# Altium schematic sheet PowerDomain.SchDoc: Shaheen PCB Board
size A3; Author: Mattia Sinigaglia; CompanyName: University of Bologna; DrawnBy: Mattia Sinigaglia; Organization: EES - Micrel Lab; Revision: v1; SheetNumber: 3; SheetTotal: 6
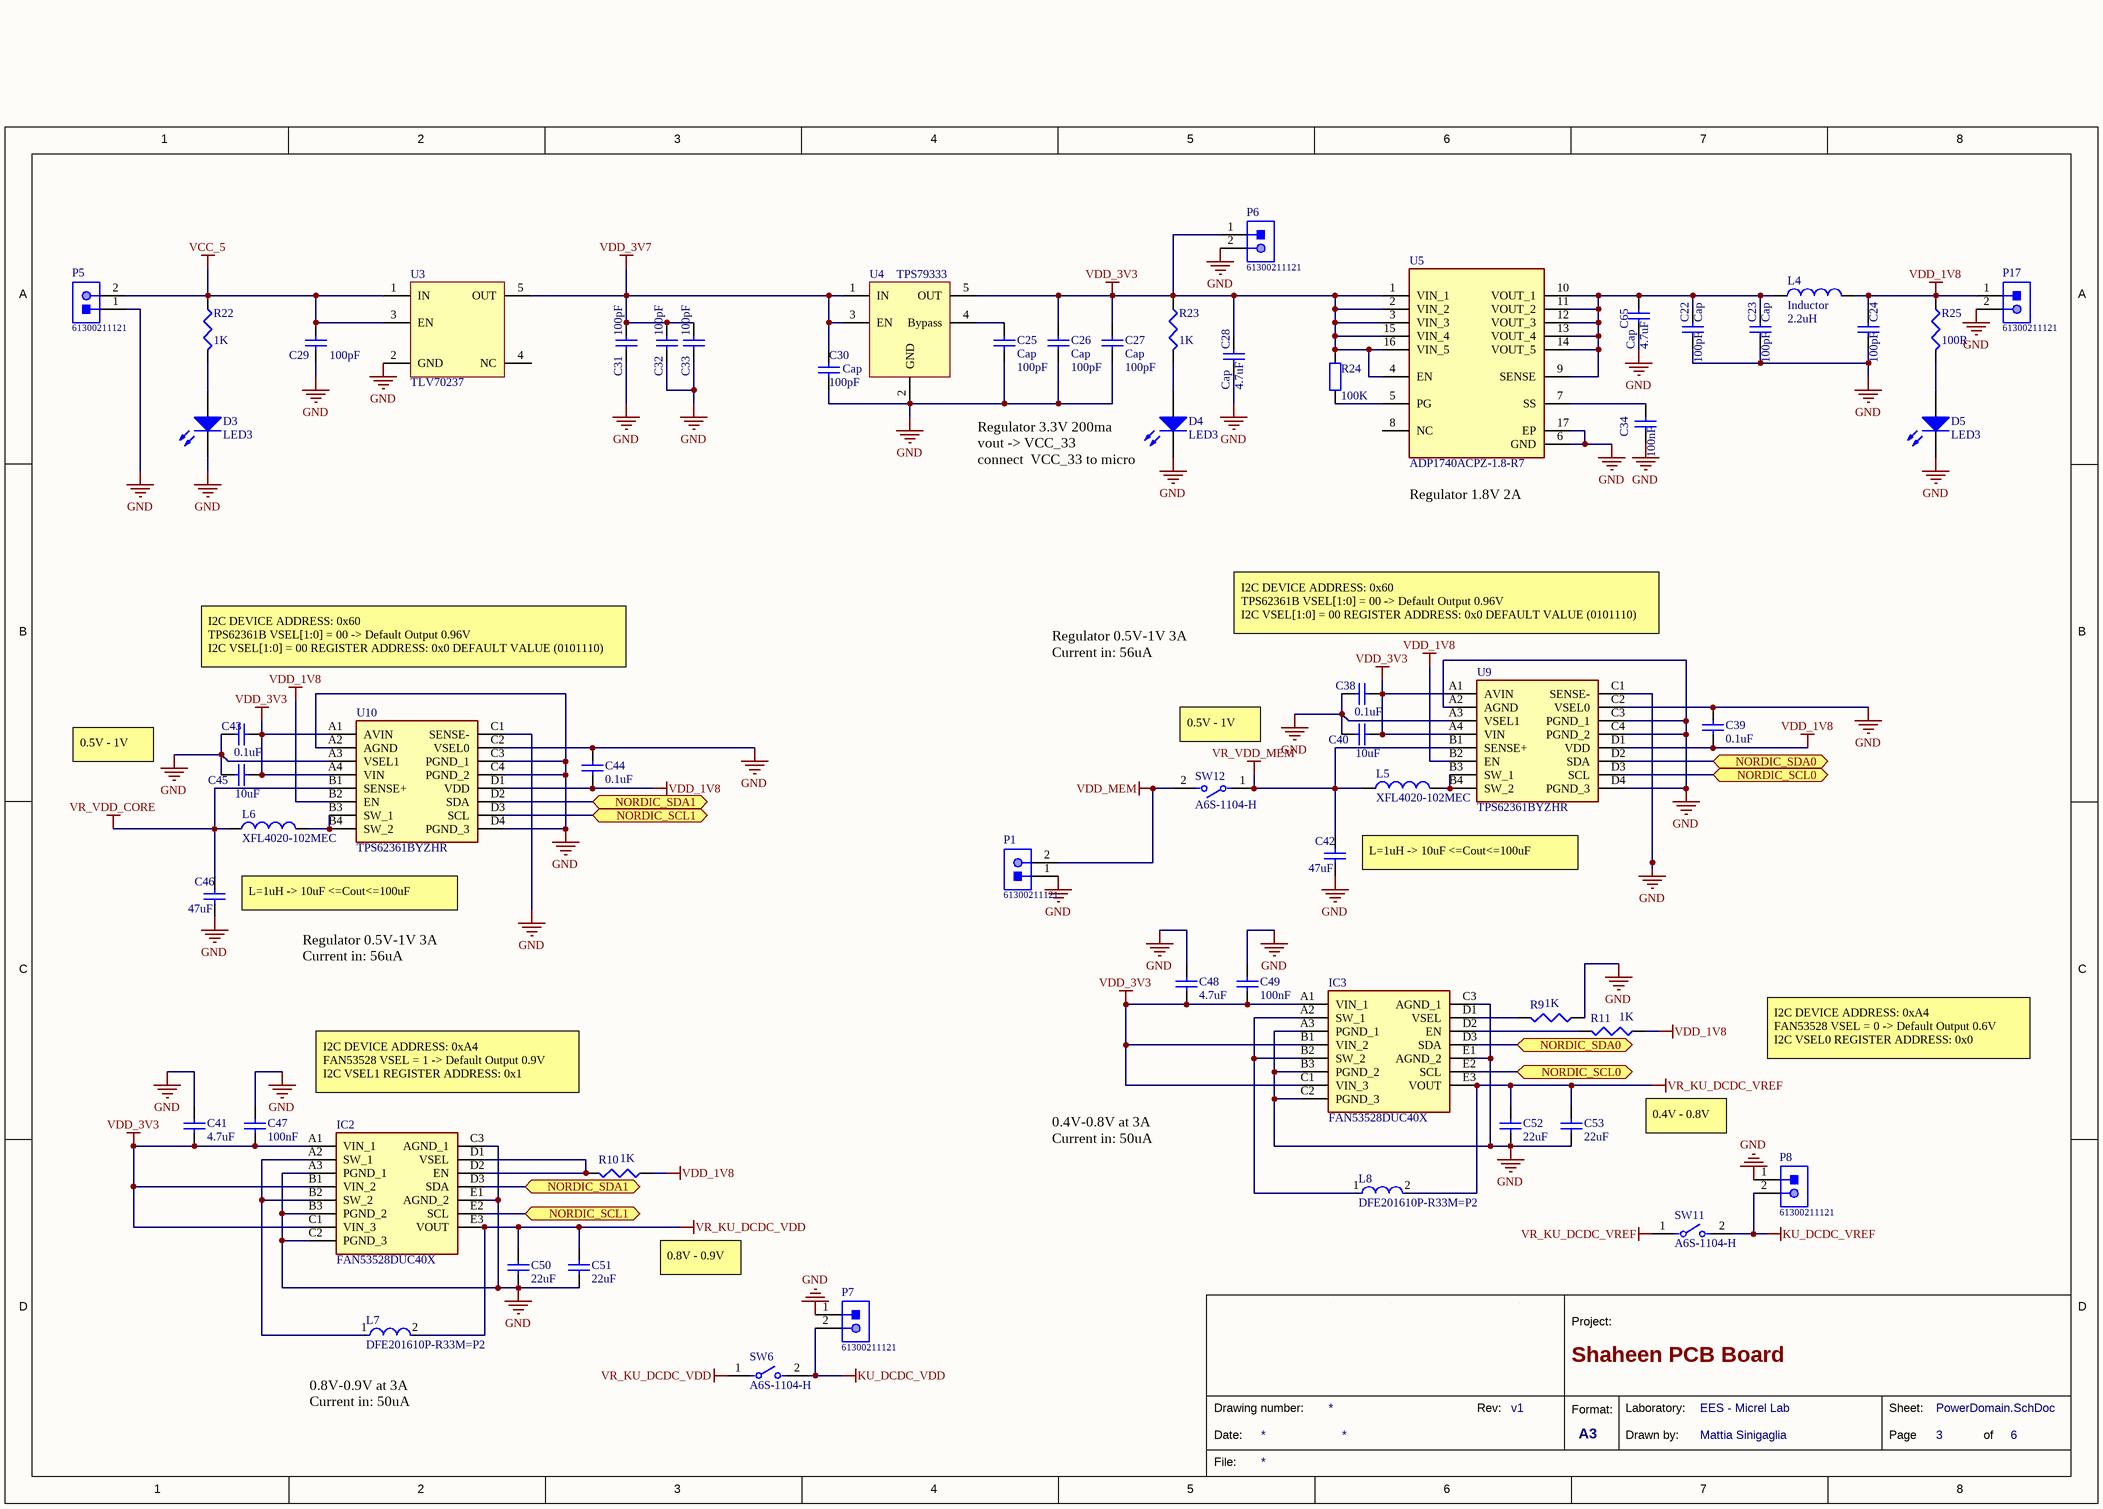
[diagram p0: PowerDomain.SchDoc]

## Parts
C22  Cap  value 100pF  [0603]
C23  Cap  value 100pF  [0603]
C24  value 100pF  [0603]  (hidden comment: Cap)
C25  Cap  value 100pF  [cap_0402_R - modified]
C26  Cap  value 100pF  [cap_0402_R - modified]
C27  Cap  value 100pF  [cap_0402_R - modified]
C28  Cap  value 4.7uF  [0603]
C29  value 100pF  [1608[0603]]  (hidden comment: Cap Semi)
C30  Cap  value 100pF  [cap_0402_R - modified]
C31  value 100pF  [1608[0603]]  (hidden comment: Cap Semi)
C32  value 100pF  [1608[0603]]  (hidden comment: Cap Semi)
C33  value 100pF  [1608[0603]]  (hidden comment: Cap Semi)
C34  value 100nF  [0603]
C38  value 0.1uF  [0603]  (hidden comment: Cap)
C39  value 0.1uF  [0603]  (hidden comment: Cap)
C40  value 10uF  [0603]  (hidden comment: Cap)
C41  value 4.7uF  [0603]  (hidden comment: Cap)
C42  value 47uF  [0603]  (hidden comment: Cap)
C43  value 0.1uF  [0603]  (hidden comment: Cap)
C44  value 0.1uF  [0603]  (hidden comment: Cap)
C45  value 10uF  [0603]  (hidden comment: Cap)
C46  value 47uF  [0603]  (hidden comment: Cap)
C47  value 100nF  [0603]  (hidden comment: Cap)
C48  value 4.7uF  [0603]  (hidden comment: Cap)
C49  value 100nF  [0603]  (hidden comment: Cap)
C50  value 22uF  [0603]  (hidden comment: Cap)
C51  value 22uF  [0603]  (hidden comment: Cap)
C52  value 22uF  [0603]  (hidden comment: Cap)
C53  value 22uF  [0603]  (hidden comment: Cap)
C65  Cap  value 4.7uF  [0603]
D3  LED3  [0603]
D4  LED3  [0603]
D5  LED3  [0603]
IC2  FAN53528DUC40X  [BGA15C40P3X5_131X202X62]
IC3  FAN53528DUC40X  [BGA15C40P3X5_131X202X62]
L4  Inductor  value 2.2uH  [0603]
L5  XFL4020-102MEC  [COIL-XFL4020_V]
L6  XFL4020-102MEC  [COIL-XFL4020_V]
L7  DFE201610P-R33M=P2  [FP-DFE201610C-MFG]
L8  DFE201610P-R33M=P2  [FP-DFE201610C-MFG]
P1  61300211121  [61300211121]
P5  61300211121  [61300211121]
P6  61300211121  [61300211121]
P7  61300211121  [61300211121]
P8  61300211121  [61300211121]
P17  61300211121  [61300211121]
R9  value 1K  [J1-0603]  (hidden comment: 0R)
R10  value 1K  [J1-0603]  (hidden comment: 0R)
R11  value 1K  [J1-0603]  (hidden comment: 0R)
R22  value 1K  [res_0402_R - modified]  (hidden comment: Res3)
R23  value 1K  [res_0402_R - modified]  (hidden comment: Res3)
R24  value 100K  [0603]
R25  value 100R  [res_0402_R - modified]  (hidden comment: Res3)
SW6  A6S-1104-H  [FP-A6S-1104-H-MFG]
SW11  A6S-1104-H  [FP-A6S-1104-H-MFG]
SW12  A6S-1104-H  [FP-A6S-1104-H-MFG]
U3  TLV70237  [SOT23__DDC__(R - PDSO-  G5)]
U4  TPS79333  [SOT_23__DBV_(R - PDSO - G5)]
U5  ADP1740ACPZ-1.8-R7  [ADP1740ACPZ-1.8-R7]
U9  TPS62361BYZHR  [BGA16C50P4X4_206X206X62]
U10  TPS62361BYZHR  [BGA16C50P4X4_206X206X62]

## Ports
NORDIC_SCL0 (bidir), NORDIC_SCL1 (bidir), NORDIC_SDA0 (bidir), NORDIC_SDA1 (bidir)

## Nets
GND: C22.2 C23.2 C24.2 C25.1 C26.2 C27.1 C28.2 C29.1 C30.1 C31.1 C32.1 C33.1 C34.2 C38.1 C39.1 C40.2 C41.1 C42.2 C43.1 C44.1 C45.2 C46.2 C47.1 C48.1 C49.1 C50.2 C51.2 C52.2 C53.2 C65.2 D3.2(K) D4.2(K) D5.2(K) IC2.A3(PGND_1) IC2.B3(PGND_2) IC2.C2(PGND_3) IC2.C3(AGND_1) IC2.E1(AGND_2) IC3.A3(PGND_1) IC3.B3(PGND_2) IC3.C2(PGND_3) IC3.C3(AGND_1) IC3.E1(AGND_2) P1.1 P5.1 P6.2 P7.1 P8.1 P17.2 R9.2 U3.2(GND) U4.2(GND) U5.6(GND) U5.17(EP) U9.A2(AGND) U9.A3(VSEL1) U9.C1(SENSE-) U9.C2(VSEL0) U9.C3(PGND_1) U9.C4(PGND_2) U9.D4(PGND_3) U10.A2(AGND) U10.A3(VSEL1) U10.C1(SENSE-) U10.C2(VSEL0) U10.C3(PGND_1) U10.C4(PGND_2) U10.D4(PGND_3)
KU_DCDC_VDD: P7.2 SW6.2
KU_DCDC_VREF: P8.2 SW11.2
VCC_5: C29.2 P5.2 R22.1 U3.1(IN) U3.3(EN)
VDD_1V8: C24.1 C39.2 C44.2 L4.2 P17.1 R10.2 R11.2 R25.1 U9.B2(EN) U9.D1(VDD) U10.B2(EN) U10.D1(VDD)
VDD_3V3: C26.1 C27.2 C28.1 C38.2 C40.1 C41.2 C43.2 C45.1 C47.2 C48.2 C49.2 IC2.A1(VIN_1) IC2.B1(VIN_2) IC2.C1(VIN_3) IC3.A1(VIN_1) IC3.B1(VIN_2) IC3.C1(VIN_3) P6.1 R23.1 R24.2 U4.5(OUT) U5.1(VIN_1) U5.2(VIN_2) U5.3(VIN_3) U5.4(EN) U5.15(VIN_4) U5.16(VIN_5) U9.A1(AVIN) U9.A4(VIN) U10.A1(AVIN) U10.A4(VIN)
VDD_3V7: C30.2 C31.2 C32.2 C33.2 U3.5(OUT) U4.1(IN) U4.3(EN)
VDD_MEM: P1.2 SW12.2
VR_KU_DCDC_VDD: C50.1 C51.1 IC2.E3(VOUT) L7.2 SW6.1
VR_KU_DCDC_VREF: C52.1 C53.1 IC3.E3(VOUT) L8.2 SW11.1
VR_VDD_CORE: C46.1 L6.1 U10.B1(SENSE+)
VR_VDD_MEM: C42.1 L5.1 SW12.1 U9.B1(SENSE+)
NORDIC_SCL0: IC3.E2(SCL) U9.D3(SCL) ; port NORDIC_SCL0
NORDIC_SCL1: IC2.E2(SCL) U10.D3(SCL) ; port NORDIC_SCL1
NORDIC_SDA0: IC3.D3(SDA) U9.D2(SDA) ; port NORDIC_SDA0
NORDIC_SDA1: IC2.D3(SDA) U10.D2(SDA) ; port NORDIC_SDA1
NetC22_1: C22.1 C23.1 C65.1 L4.1 U5.9(SENSE) U5.10(VOUT_1) U5.11(VOUT_2) U5.12(VOUT_3) U5.13(VOUT_4) U5.14(VOUT_5)
NetC25_2: C25.2 U4.4(Bypass)
NetC34_1: C34.1 U5.7(SS)
NetD3_1: D3.1(A) R22.2
NetD4_1: D4.1(A) R23.2
NetD5_1: D5.1(A) R25.2
NetIC2_A2: IC2.A2(SW_1) IC2.B2(SW_2) L7.1
NetIC2_D1: IC2.D1(VSEL) IC2.D2(EN) R10.1
NetIC3_A2: IC3.A2(SW_1) IC3.B2(SW_2) L8.1
NetIC3_D1: IC3.D1(VSEL) R9.1
NetIC3_D2: IC3.D2(EN) R11.1
NetL5_2: L5.2 U9.B3(SW_1) U9.B4(SW_2)
NetL6_2: L6.2 U10.B3(SW_1) U10.B4(SW_2)
NetR24_1: R24.1 U5.5(PG)

Not connected (* = marked no-connect by the designer): U3 4(NC); U5 8(NC)

## Notes on the sheet
- Regulator 3.3V 200ma
  vout -> VCC_33
  connect  VCC_33 to micro
- (near U5) Regulator 1.8V 2A
- I2C DEVICE ADDRESS: 0x60
  TPS62361B VSEL[1:0] = 00 -> Default Output 0.96V
  I2C VSEL[1:0] = 00 REGISTER ADDRESS: 0x0 DEFAULT VALUE (0101110)
- Regulator 0.5V-1V 3A
  Current in: 56uA
- 0.5V - 1V
- (near SW12) 0.5V - 1V
- (near C46) L=1uH -> 10uF <=Cout<=100uF
- (near C42) L=1uH -> 10uF <=Cout<=100uF
- I2C DEVICE ADDRESS: 0xA4
  FAN53528 VSEL = 0 -> Default Output 0.6V
  I2C VSEL0 REGISTER ADDRESS: 0x0
- I2C DEVICE ADDRESS: 0xA4
  FAN53528 VSEL = 1 -> Default Output 0.9V
  I2C VSEL1 REGISTER ADDRESS: 0x1
- 0.4V - 0.8V
- 0.4V-0.8V at 3A
  Current in: 50uA
- 0.8V - 0.9V
- (near L7) 0.8V-0.9V at 3A
  Current in: 50uA
- 1
- 2
- 3
- 4
- 5
- 6
- 7
- 8
- A
- B
- C
- D
- Project:
- Date:
- Drawing number:
- Rev:
- Format:
- A3
- Drawn by:
- Laboratory:
- Page
- Sheet:
- of
- File:

## Library data of the parts
C22-C28 C30 C34 C38-C53 C65 = Cap: Capacitor; Published: 8-Jun-2000; LatestRevisionDate: 17-Jul-2002; LatestRevisionNote: Re-released for DXP Platform.; PackageReference: RAD-0.3; Publisher: Altium Limited; PackageDescription: Radial Cap, Thru-Hole; 2 Leads; 0.3 in Pin Spacing
C29 C31-C33 = Cap Semi: Capacitor (Semiconductor SIM Model); Published: 8-Jun-2000; LatestRevisionDate: 29-May-2009; LatestRevisionNote: IPC-7351 Footprint Added.; PackageReference: C1206; Publisher: Altium Limited; PackageDescription: Chip Capacitor
D3-D5 = LED3: Typical BLUE SiC LED; Published: 8-Jun-2000; LatestRevisionDate: 17-Dec-2003; LatestRevisionNote: PCB Footprint replaced.; DatasheetVersion: 16-Apr-2002; PackageVersion: 16-Apr-2002; PackageReference: 3.5X2.8X1.9; Publisher: Altium Limited; PackageDescription: SM LED; 2 C-Bend Leads; Body 3.5 x 2.8 x 1.9 mm, inc leads (LxWxH typ)
IC2 IC3 = FAN53528DUC40X: Integrated Circuit; Manufacturer_Name: onsemi; Datasheet Link: https://www.onsemi.com/pub/Collateral/FAN53528-D.PDF; Height: 0.625mm; Manufacturer_Part_Number: FAN53528DUC40X
L4 = Inductor: Code_IEC: 1005; Published: 8-Jun-2000; LatestRevisionDate: 29-May-2009; LatestRevisionNote: IPC-7351 Footprint Added.; PackageReference: 0402-A; Publisher: Altium Limited; PackageDescription: Chip Inductor; Code_JEITA: 0402
L5 L6 = CMP-2000-07423-1: Shielded Power Inductor, 1 uH, 64 MHz, -40 to 125 degC, 2-Pin SMD, RoHS, Tape and Reel; Manufacturer: Coilcraft; Case Width: 4.3mm; Case Height: 2.1mm; Maximum DC Current: 11A; Core Material: Composite; Test Frequency: 100kHz; Tolerance: 20%; Maximum DC Resistance: 11.9mOhms; Inductance: 1uH; Self Resonant Frequency: 64MHz; RoHS: Details; Series: XFL4020; Case Length: 4.3mm; Package Reference: XFL4020; Dimensions: 4.3mmWx4.3mmLx2.1mmH; Product: PowerInductors; Datasheet Version: 07/2012; Manufacturer URL: http://www.coilcraft.com/; Termination Style: SMD/SMT; Mounting Technology: SurfaceMount; Operating Temperature Range: -40Cto+125C; Package Description: 2-Pin Surface Mount Device, Body 4 x 4 mm, Pitch 2.37 mm; Shielding: Shielded; Packaging: Reel; Datasheet URL: http://www.mouser.com/ds/2/597/xfl4020-270756.pdf
L7 L8 = CMP-06042-003298-1: Shielded Wirewound Inductor 0.33uH 20% 3500mA 0.034Ω 0806 (2016); Current Rating: 4.7A; DC Resistance (DCR): 34mR; Max DC Current: 3.5A; Test Frequency: 1MHz; Inductance: 330nH; Core Material: Ferrite; Case Code (Imperial): 0806; Case Code (Metric): 2016; Width: 0.063inch; Packaging: Tape and Reel; Mount: Surface Mount; Min Operating Temperature: -40°C; Length: 0.079inch; Case/Package: 0806; Height - Seated (Max): 0.039inch; Max Operating Temperature: 125°C; Shielding: Shielded; Tolerance: 20%; Depth: 1.6mm; Resistor Type: Wirewound
P1 P5-P8 P17 = CMP-1712-00002-4: THT Vertical Pin Header WR-PHD, Pitch 2.54 mm, Single Row, 2 pins; Manufacturer: Wurth Elektronik; Rated Current: 3A; Gender: Male; Withstanding Voltage: 500VAC; Working Voltage: 250VAC; Pitch: 2.54mm; Contact Resistance: 20mOhm; Pin Number: 2; Mounting Technology: THT; Orientation: Vertical; Operating Temperature: -40to105degC; Packaging: Bag; Publisher: WurthElektronik; Datasheet URL: https://katalog.we-online.de/em/datasheet/6130xx11121.pdf; Manufacturer URL: http://www.we-online.de; Row Number: Single; Package Reference: 61300211121; Part Number: 61300211121
R9-R11 R22 R23 R25 = Res3: Resistor; Published: 8-Jun-2000; LatestRevisionDate: 29-May-2009; LatestRevisionNote: IPC-7351 Footprint Added.; PackageReference: J1-0603; Publisher: Altium Limited; PackageDescription: Chip Resistor
R24 = Res2: Resistor; Published: 8-Jun-2000; LatestRevisionDate: 17-Jul-2002; LatestRevisionNote: Re-released for DXP Platform.; PackageReference: AXIAL-0.4; Publisher: Altium Limited; PackageDescription: Axial Device, Thru-Hole; 2 Leads; 0.4 in Pin Spacing
SW6 SW11 SW12 = CMP-08827-000005-1: SWITCH SLIDE DIP SPST 25MA 24V; Manufacturer: Omron Electronics Inc-EMC Div; Throw Configuration: SPST-NO; Standoff Height: 0mm; Number Of Circuits: 1; Electromechanical Life: 1000Cycles; Contact Resistance: 200mΩ; Digikey Description: SWITCH SLIDE DIP SPST 25MA 24V; ComponentLink2Description: Datasheet; Mount: Surface Mount; Manufacturer Part Number: A6S-1104-H; ComponentLink2URL: https://omronfs.omron.com/en_US/ecb/products/pdf/en-a6s.pdf; Category: Switch; Height: 3.95mm; Device Class L3: DIP Switches; Octopart: https://octopart.com/a6s-1104-h-omron-55410938; Mouser Description: DIP Switches / SIP Switches Dip Switch; Lead Free: Yes; Temperature Range Low: -20°C; Temperature Range High: +70°C; Automotive: No; Ambient Temperature Range Low: -20°C; Ambient Temperature Range High: +70°C; Voltage Rating Dc: 24V; Device Class L2: Switches; RoHS: TRUE; Package: 0; Contact Current Rating: 25mA; Device Class L1: Electromechanical; Temperature: -20°C to +70°C
U3 = TLV70237: Linear Regulator
U4 = TPS79333: Regulator
U5 = ADP1740ACPZ-1.8-R7: LDO Voltage Regulators 2A LDO Fix V-out Family; Manufacturer_Name: Analog Devices; Geometry.Height: 0.8mm; Mouser Part Number: 584-ADP1740ACPZ1.8R7; Mouser Price/Stock: https://www.mouser.co.uk/ProductDetail/Analog-Devices/ADP1740ACPZ-18-R7?qs=WIvQP4zGanhn2jVFfFpW%2Fg%3D%3D; Manufacturer_Part_Number: ADP1740ACPZ-1.8-R7; Datasheet Link: https://componentsearchengine.com/Datasheets/2/ADP1740ACPZ-1.8-R7.pdf
U9 U10 = TPS62361BYZHR: Integrated Circuit; Manufacturer_Name: Texas Instruments; Datasheet Link: http://www.ti.com/lit/gpn/tps62361b; Height: 0.625mm; Manufacturer_Part_Number: TPS62361BYZHR